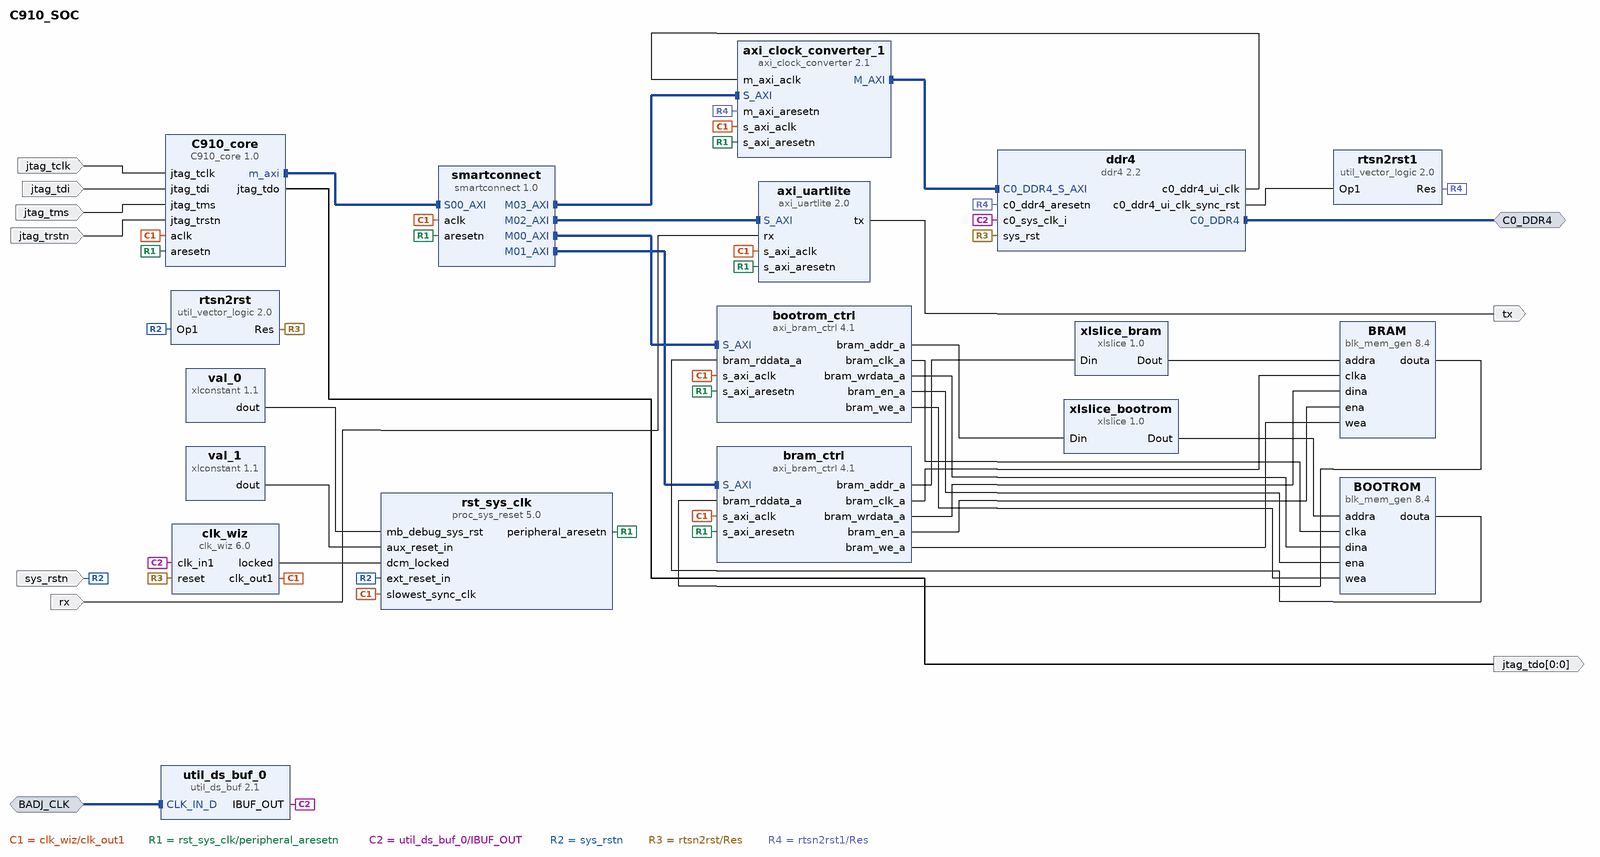
[diagram p0: block diagram of the top level]
# Vivado block design C910_SOC, xcvu13p-fhgb2104-2-i, Vivado 2020.2
create_bd_design C910_SOC

create_bd_intf_port -mode Master -vlnv xilinx.com:interface:ddr4_rtl:1.0 C0_DDR4
create_bd_intf_port -mode Slave -vlnv xilinx.com:interface:diff_clock_rtl:1.0 BADJ_CLK
set_property -dict {CONFIG.FREQ_HZ 200000000} [get_bd_intf_ports BADJ_CLK]
create_bd_port -dir I -type rst sys_rstn
create_bd_port -dir O tx
create_bd_port -dir I rx
create_bd_port -dir I jtag_tclk
create_bd_port -dir I jtag_tdi
create_bd_port -dir I jtag_tms
create_bd_port -dir I jtag_trstn
create_bd_port -dir O -from 0 -to 0 jtag_tdo

create_bd_cell -type ip -vlnv xilinx.com:ip:axi_bram_ctrl:4.1 bootrom_ctrl
set_property -dict {CONFIG.DATA_WIDTH 128 CONFIG.PROTOCOL AXI4 CONFIG.SINGLE_PORT_BRAM 1} [get_bd_cells bootrom_ctrl]
create_bd_cell -type ip -vlnv xilinx.com:ip:axi_uartlite:2.0 axi_uartlite
set_property -dict {CONFIG.C_BAUDRATE 115200 CONFIG.C_S_AXI_ACLK_FREQ_HZ 50000000} [get_bd_cells axi_uartlite]
create_bd_cell -type ip -vlnv xilinx.com:ip:blk_mem_gen:8.4 BOOTROM
set_property -dict [list \
  CONFIG.Byte_Size 8 \
  CONFIG.Coe_File ../../../../../../../../MAKEFILE/COEFILES/build_bootrom/bootrom.coe \
  CONFIG.Enable_32bit_Address false \
  CONFIG.Load_Init_File true \
  CONFIG.Read_Width_A 128 \
  CONFIG.Register_PortA_Output_of_Memory_Primitives false \
  CONFIG.Use_Byte_Write_Enable true \
  CONFIG.Use_RSTA_Pin false \
  CONFIG.Write_Depth_A 256 \
  CONFIG.Write_Width_A 128 \
  CONFIG.use_bram_block Stand_Alone \
] [get_bd_cells BOOTROM]
create_bd_cell -type ip -vlnv xilinx.com:ip:blk_mem_gen:8.4 BRAM
set_property -dict [list \
  CONFIG.Byte_Size 8 \
  CONFIG.Coe_File ../../../../../../../../MAKEFILE/COEFILES/build_ram/bram.coe \
  CONFIG.Enable_32bit_Address false \
  CONFIG.Load_Init_File true \
  CONFIG.Read_Width_A 128 \
  CONFIG.Register_PortA_Output_of_Memory_Primitives false \
  CONFIG.Use_Byte_Write_Enable true \
  CONFIG.Use_RSTA_Pin false \
  CONFIG.Write_Depth_A 4096 \
  CONFIG.Write_Width_A 128 \
  CONFIG.use_bram_block Stand_Alone \
] [get_bd_cells BRAM]
create_bd_cell -type ip -vlnv xilinx.com:ip:axi_bram_ctrl:4.1 bram_ctrl
set_property -dict {CONFIG.DATA_WIDTH 128 CONFIG.SINGLE_PORT_BRAM 1} [get_bd_cells bram_ctrl]
create_bd_cell -type ip -vlnv xilinx.com:ip:proc_sys_reset:5.0 rst_sys_clk
create_bd_cell -type ip -vlnv xilinx.com:ip:smartconnect:1.0 smartconnect
set_property -dict {CONFIG.NUM_MI 4 CONFIG.NUM_SI 1} [get_bd_cells smartconnect]
create_bd_cell -type ip -vlnv xilinx.com:ip:xlconstant:1.1 val_0
set_property -dict {CONFIG.CONST_VAL 0} [get_bd_cells val_0]
create_bd_cell -type ip -vlnv xilinx.com:ip:xlconstant:1.1 val_1
create_bd_cell -type ip -vlnv xilinx.com:ip:xlslice:1.0 xlslice_bootrom
set_property -dict {CONFIG.DIN_FROM 11 CONFIG.DIN_TO 4 CONFIG.DIN_WIDTH 13 CONFIG.DOUT_WIDTH 8} [get_bd_cells xlslice_bootrom]
create_bd_cell -type ip -vlnv xilinx.com:ip:xlslice:1.0 xlslice_bram
set_property -dict {CONFIG.DIN_FROM 15 CONFIG.DIN_TO 4 CONFIG.DIN_WIDTH 16 CONFIG.DOUT_WIDTH 12} [get_bd_cells xlslice_bram]
create_bd_cell -type ip -vlnv xilinx.com:ip:ddr4:2.2 ddr4
set_property -dict [list \
  CONFIG.C0.DDR4_AxiAddressWidth 33 \
  CONFIG.C0.DDR4_AxiDataWidth 128 \
  CONFIG.C0.DDR4_CasWriteLatency 12 \
  CONFIG.C0.DDR4_DataWidth 64 \
  CONFIG.C0.DDR4_InputClockPeriod 4998 \
  CONFIG.C0.DDR4_MemoryPart MTA8ATF1G64HZ-2G3 \
  CONFIG.C0.DDR4_MemoryType SODIMMs \
  CONFIG.C0.DDR4_TimePeriod 833 \
  CONFIG.System_Clock No_Buffer \
] [get_bd_cells ddr4]
create_bd_cell -type ip -vlnv xilinx.com:ip:clk_wiz:6.0 clk_wiz
set_property -dict [list \
  CONFIG.CLKIN1_JITTER_PS 50.0 \
  CONFIG.CLKOUT1_JITTER 121.478 \
  CONFIG.CLKOUT1_PHASE_ERROR 82.655 \
  CONFIG.CLKOUT1_REQUESTED_OUT_FREQ 50 \
  CONFIG.MMCM_CLKFBOUT_MULT_F 6.000 \
  CONFIG.MMCM_CLKIN1_PERIOD 5.000 \
  CONFIG.MMCM_CLKIN2_PERIOD 10.0 \
  CONFIG.MMCM_CLKOUT0_DIVIDE_F 24.000 \
  CONFIG.PRIM_IN_FREQ 200 \
] [get_bd_cells clk_wiz]
create_bd_cell -type ip -vlnv xilinx.com:ip:util_vector_logic:2.0 rtsn2rst
set_property -dict {CONFIG.C_OPERATION not CONFIG.C_SIZE 1} [get_bd_cells rtsn2rst]
create_bd_cell -type ip -vlnv xilinx.com:ip:util_ds_buf:2.1 util_ds_buf_0
set_property -dict {CONFIG.C_BUF_TYPE IBUFDS} [get_bd_cells util_ds_buf_0]
create_bd_cell -type ip -vlnv xilinx.com:ip:axi_clock_converter:2.1 axi_clock_converter_1
set_property -dict {CONFIG.ADDR_WIDTH 33 CONFIG.DATA_WIDTH 128} [get_bd_cells axi_clock_converter_1]
create_bd_cell -type ip -vlnv xilinx.com:ip:util_vector_logic:2.0 rtsn2rst1
set_property -dict {CONFIG.C_OPERATION not CONFIG.C_SIZE 1} [get_bd_cells rtsn2rst1]
create_bd_cell -type ip -vlnv user.org:user:C910_core:1.0 C910_core

# ---- connections ----

connect_bd_intf_net -intf_net ddr4_0_C0_DDR4 [get_bd_intf_ports C0_DDR4] [get_bd_intf_pins ddr4/C0_DDR4]
connect_bd_intf_net -intf_net smartconnect_0_M01_AXI [get_bd_intf_pins bram_ctrl/S_AXI] [get_bd_intf_pins smartconnect/M01_AXI]
connect_bd_intf_net [get_bd_intf_pins smartconnect/M03_AXI] [get_bd_intf_pins axi_clock_converter_1/S_AXI]
connect_bd_intf_net -intf_net smartconnect_0_M00_AXI [get_bd_intf_pins bootrom_ctrl/S_AXI] [get_bd_intf_pins smartconnect/M00_AXI]
connect_bd_intf_net -intf_net C910_core_0_m_axi [get_bd_intf_pins C910_core/m_axi] [get_bd_intf_pins smartconnect/S00_AXI]
connect_bd_intf_net [get_bd_intf_pins axi_clock_converter_1/M_AXI] [get_bd_intf_pins ddr4/C0_DDR4_S_AXI]
connect_bd_intf_net -intf_net CLK_IN_D_0_1 [get_bd_intf_ports BADJ_CLK] [get_bd_intf_pins util_ds_buf_0/CLK_IN_D]
connect_bd_intf_net -intf_net smartconnect_0_M02_AXI [get_bd_intf_pins smartconnect/M02_AXI] [get_bd_intf_pins axi_uartlite/S_AXI]
connect_bd_net -net sys_clk_1 [get_bd_pins clk_wiz/clk_out1] \
  [get_bd_pins bootrom_ctrl/s_axi_aclk] [get_bd_pins axi_uartlite/s_axi_aclk] [get_bd_pins bram_ctrl/s_axi_aclk] \
  [get_bd_pins rst_sys_clk/slowest_sync_clk] [get_bd_pins smartconnect/aclk] [get_bd_pins axi_clock_converter_1/s_axi_aclk] \
  [get_bd_pins C910_core/aclk]
connect_bd_net [get_bd_pins rst_sys_clk/peripheral_aresetn] \
  [get_bd_pins bootrom_ctrl/s_axi_aresetn] [get_bd_pins axi_uartlite/s_axi_aresetn] [get_bd_pins bram_ctrl/s_axi_aresetn] \
  [get_bd_pins smartconnect/aresetn] [get_bd_pins axi_clock_converter_1/s_axi_aresetn] [get_bd_pins C910_core/aresetn]
connect_bd_net [get_bd_pins val_0/dout] [get_bd_pins rst_sys_clk/mb_debug_sys_rst]
connect_bd_net -net axi_uartlite_0_tx [get_bd_pins axi_uartlite/tx] [get_bd_ports tx]
connect_bd_net [get_bd_ports rx] [get_bd_pins axi_uartlite/rx]
connect_bd_net [get_bd_ports jtag_tclk] [get_bd_pins C910_core/jtag_tclk]
connect_bd_net [get_bd_ports jtag_tdi] [get_bd_pins C910_core/jtag_tdi]
connect_bd_net [get_bd_ports jtag_tms] [get_bd_pins C910_core/jtag_tms]
connect_bd_net [get_bd_ports jtag_trstn] [get_bd_pins C910_core/jtag_trstn]
connect_bd_net [get_bd_pins C910_core/jtag_tdo] [get_bd_ports jtag_tdo]
connect_bd_net [get_bd_pins bootrom_ctrl/bram_clk_a] [get_bd_pins BOOTROM/clka]
connect_bd_net [get_bd_pins bootrom_ctrl/bram_wrdata_a] [get_bd_pins BOOTROM/dina]
connect_bd_net [get_bd_pins BOOTROM/douta] [get_bd_pins bootrom_ctrl/bram_rddata_a]
connect_bd_net [get_bd_pins bootrom_ctrl/bram_en_a] [get_bd_pins BOOTROM/ena]
connect_bd_net [get_bd_pins bootrom_ctrl/bram_we_a] [get_bd_pins BOOTROM/wea]
connect_bd_net [get_bd_pins bootrom_ctrl/bram_addr_a] [get_bd_pins xlslice_bootrom/Din]
connect_bd_net -net xlslice_0_Dout [get_bd_pins xlslice_bootrom/Dout] [get_bd_pins BOOTROM/addra]
connect_bd_net [get_bd_pins bram_ctrl/bram_clk_a] [get_bd_pins BRAM/clka]
connect_bd_net [get_bd_pins xlslice_bram/Dout] [get_bd_pins BRAM/addra]
connect_bd_net [get_bd_pins bram_ctrl/bram_addr_a] [get_bd_pins xlslice_bram/Din]
connect_bd_net [get_bd_pins bram_ctrl/bram_wrdata_a] [get_bd_pins BRAM/dina]
connect_bd_net [get_bd_pins BRAM/douta] [get_bd_pins bram_ctrl/bram_rddata_a]
connect_bd_net [get_bd_pins bram_ctrl/bram_en_a] [get_bd_pins BRAM/ena]
connect_bd_net [get_bd_pins bram_ctrl/bram_we_a] [get_bd_pins BRAM/wea]
connect_bd_net -net sys_clk_200m [get_bd_pins util_ds_buf_0/IBUF_OUT] [get_bd_pins clk_wiz/clk_in1] [get_bd_pins ddr4/c0_sys_clk_i]
connect_bd_net -net ddr4_0_c0_ddr4_ui_clk [get_bd_pins ddr4/c0_ddr4_ui_clk] [get_bd_pins axi_clock_converter_1/m_axi_aclk]
connect_bd_net -net ddr4_0_c0_ddr4_ui_clk_sync_rst [get_bd_pins ddr4/c0_ddr4_ui_clk_sync_rst] [get_bd_pins rtsn2rst1/Op1]
connect_bd_net [get_bd_ports sys_rstn] [get_bd_pins rst_sys_clk/ext_reset_in] [get_bd_pins rtsn2rst/Op1]
connect_bd_net [get_bd_pins rtsn2rst/Res] [get_bd_pins clk_wiz/reset] [get_bd_pins ddr4/sys_rst]
connect_bd_net [get_bd_pins val_1/dout] [get_bd_pins rst_sys_clk/aux_reset_in]
connect_bd_net [get_bd_pins clk_wiz/locked] [get_bd_pins rst_sys_clk/dcm_locked]
connect_bd_net [get_bd_pins rtsn2rst1/Res] [get_bd_pins axi_clock_converter_1/m_axi_aresetn] [get_bd_pins ddr4/c0_ddr4_aresetn]

# ---- address map ----
assign_bd_address -offset 0x0000000000 -range 4K -target_address_space [get_bd_addr_spaces C910_core/m_axi] [get_bd_addr_segs bootrom_ctrl/S_AXI/Mem0]
assign_bd_address -offset 0x0000010000 -range 64K -target_address_space [get_bd_addr_spaces C910_core/m_axi] [get_bd_addr_segs bram_ctrl/S_AXI/Mem0]
assign_bd_address -offset 0x0040000000 -range 4K -target_address_space [get_bd_addr_spaces C910_core/m_axi] [get_bd_addr_segs axi_uartlite/S_AXI/Reg]
assign_bd_address -offset 0x0200000000 -range 8G -target_address_space [get_bd_addr_spaces C910_core/m_axi] [get_bd_addr_segs ddr4/C0_DDR4_MEMORY_MAP/C0_DDR4_ADDRESS_BLOCK]

validate_bd_design
save_bd_design
